# Altium schematic sheet Top.SchDoc: Test
size A4; DrawnBy: Łukasz Przeniosło; Organization: Zachodniopomorski; Address1: Uniwersytet Technologiczny; Address2: w Szczecinie; Address3: Wydział Elektryczny; DocumentNumber: 1111; Revision: 1.0; SheetNumber: 0; SheetTotal: 0
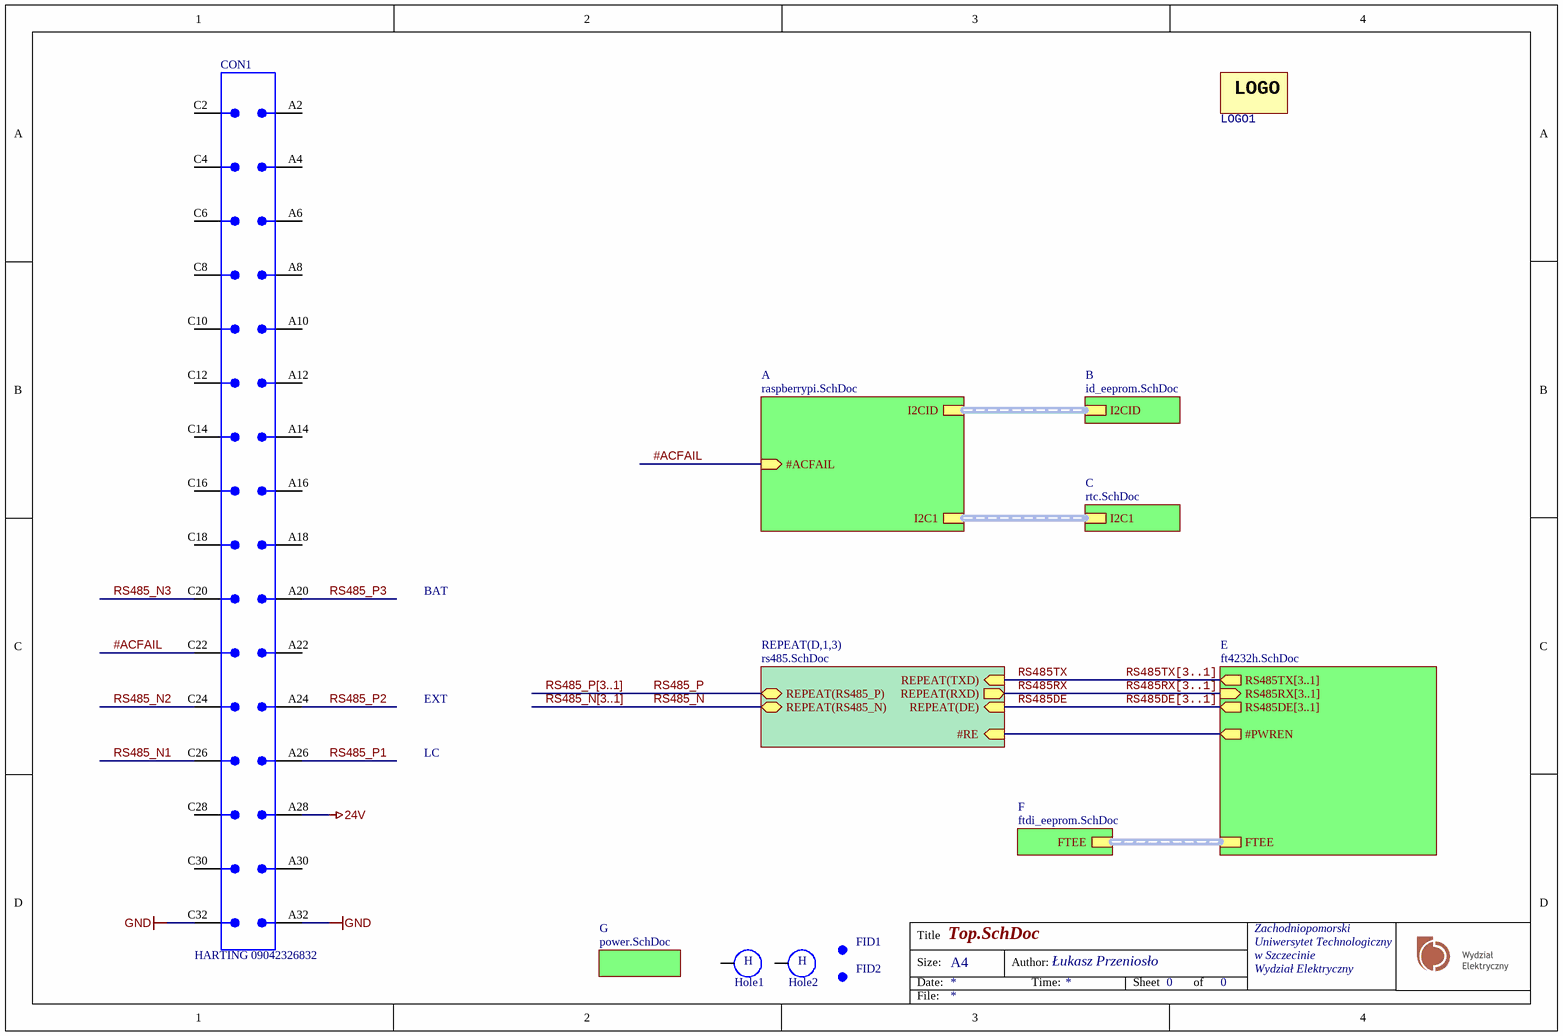
[diagram p0: Top.SchDoc]

## Parts
CON1  HARTING 09042326832  [HARTING 09041326921]
FID1  Fiducial  [Fid Round]  (value not drawn)  (no BOM)
FID2  Fiducial  [Fid Round]  (value not drawn)  (no BOM)
Hole1  Hole  [Hole-3/6]  (value not drawn)
Hole2  Hole  [Hole-3/6]  (value not drawn)
LOGO1  Logo  [LOGO_BEMKO]  (value not drawn)

## Sub-sheets
A = raspberrypi.SchDoc: I2CID (harness I2CID), I2C1 (harness I2C1), #ACFAIL (in)
B = id_eeprom.SchDoc: I2CID (harness I2CID)
C = rtc.SchDoc: I2C1 (harness I2C1)
E = ft4232h.SchDoc: #PWREN (out), FTEE (harness FTEE), RS485DE[3..1] (out), RS485RX[3..1] (in), RS485TX[3..1] (out)
F = ftdi_eeprom.SchDoc: FTEE (harness FTEE)
G = power.SchDoc: no entries
REPEAT(D,1,3) = rs485.SchDoc: REPEAT(TXD) (in), REPEAT(RXD) (out), REPEAT(DE) (in), #RE (in), REPEAT(RS485_N) (bidir), REPEAT(RS485_P) (bidir)

## Nets
24V: CON1.A28
GND: CON1.A32 CON1.C32
#ACFAIL: CON1.C22 ; sheet A/#ACFAIL
RS485_N: sheet REPEAT(D,1,3)/REPEAT(RS485_N)
RS485_N1: CON1.C26
RS485_N2: CON1.C24
RS485_N3: CON1.C20
RS485_P: sheet REPEAT(D,1,3)/REPEAT(RS485_P)
RS485_P1: CON1.A26
RS485_P2: CON1.A24
RS485_P3: CON1.A20
RS485DE: sheet REPEAT(D,1,3)/REPEAT(DE)
RS485RX: sheet REPEAT(D,1,3)/REPEAT(RXD)
RS485TX: sheet REPEAT(D,1,3)/REPEAT(TXD)
(unnamed): sheet E/#PWREN, sheet REPEAT(D,1,3)/#RE

Not connected (* = marked no-connect by the designer): CON1 A2 A4 A6 A8 A10 A12 A14 A16 A18 A22 A30 C2 C4 C6 C8 C10 C12 C14 C16 C18 C28 C30; Hole1 1; Hole2 1

## Buses and harness runs
bus RS485_N[3..1]
bus RS485_P[3..1]
bus RS485DE[3..1] = sheet E/RS485DE[3..1]
bus RS485RX[3..1] = sheet E/RS485RX[3..1]
bus RS485TX[3..1] = sheet E/RS485TX[3..1]
harness sheet A/I2C1 = sheet C/I2C1
harness sheet A/I2CID = sheet B/I2CID
harness sheet E/FTEE = sheet F/FTEE

## Notes on the sheet
- BAT
- EXT
- LC
- Title
- Size:
- Date:
- A4
- Author:
- Time:
- Sheet
- of
- File:
- (in symbol HOLE_) H
- (in symbol Logo) LOGO

## Library data of the parts
CON1 = HARTING_09042326832: Board-to-Board Connector, Eurocard VME, Vertical, 3-Row, 32-Position,
FID1 FID2 = FID ROUND: round fiducial
Hole1 Hole2 = HOLE_